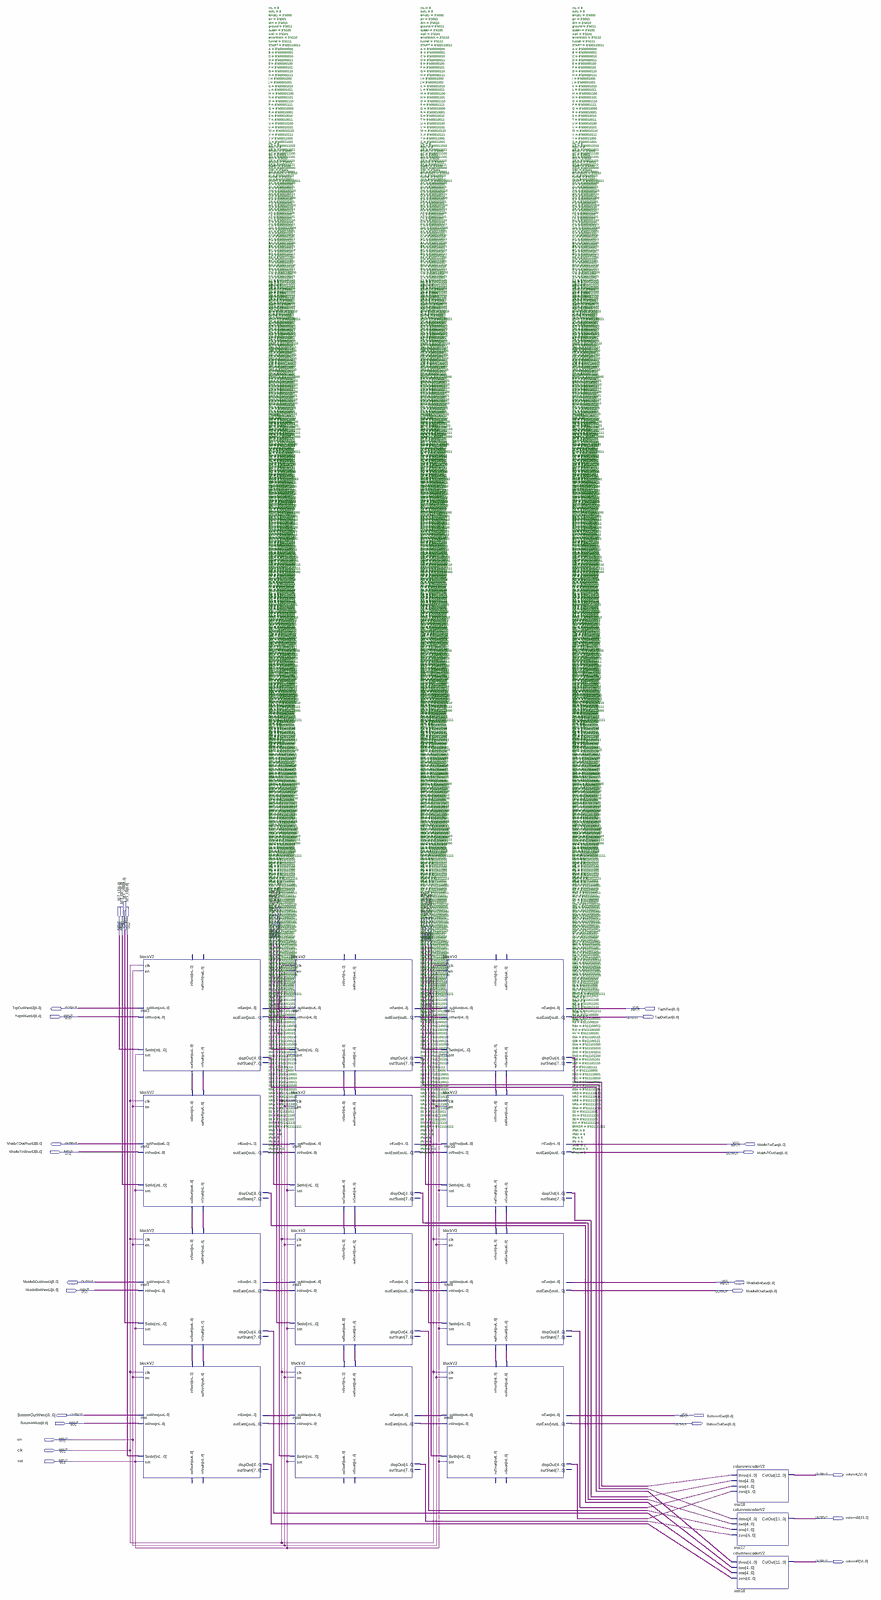
[diagram p0: schematic sheet, whole]
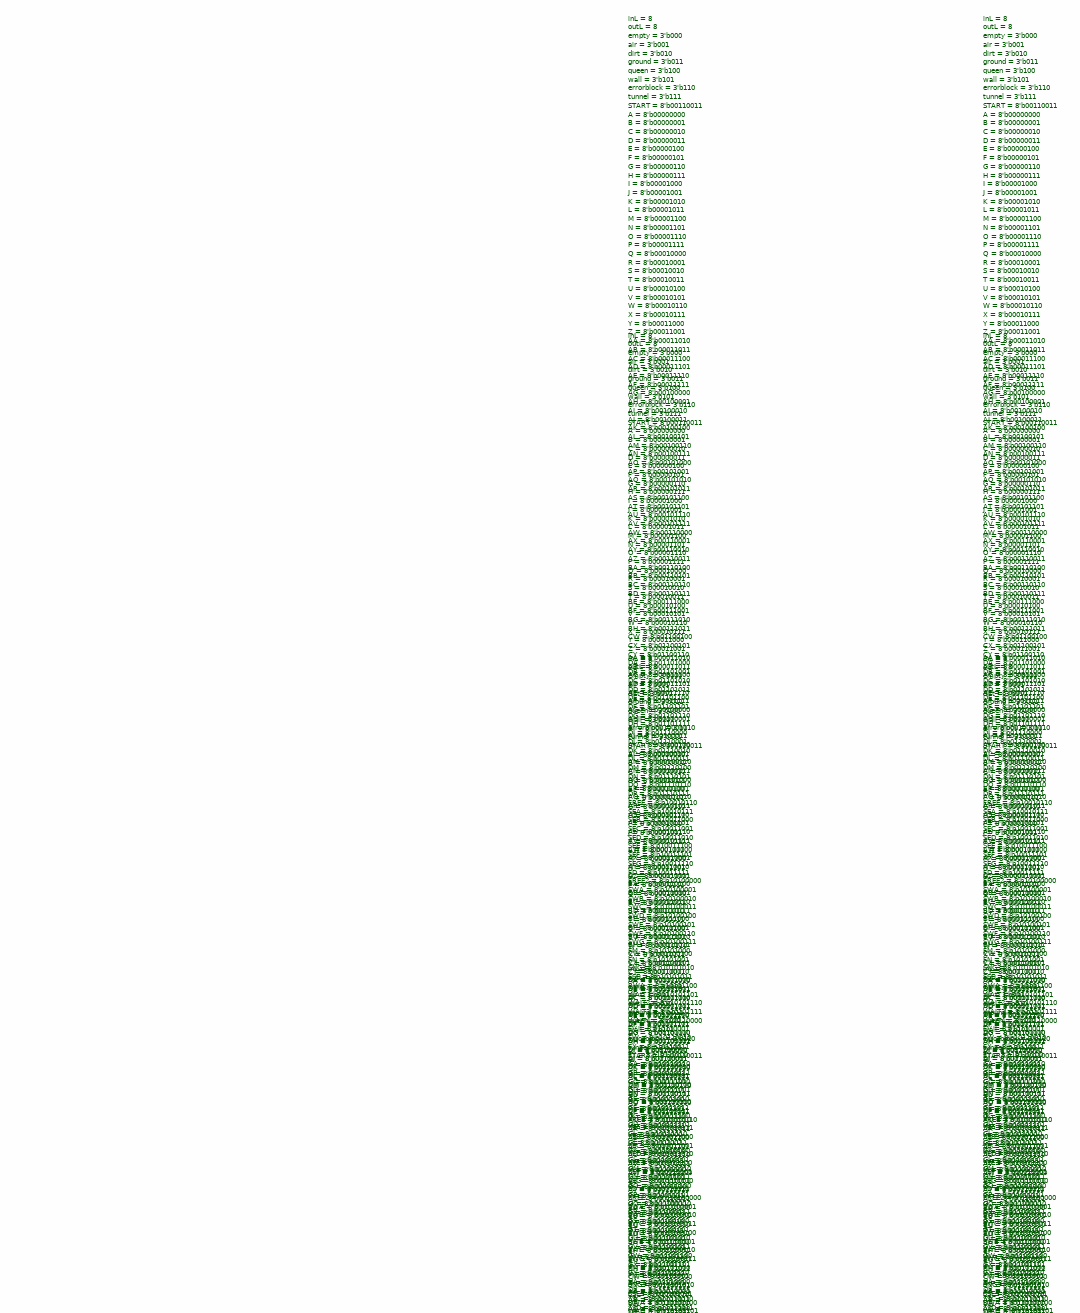
[diagram p1: schematic sheet, upper left part]
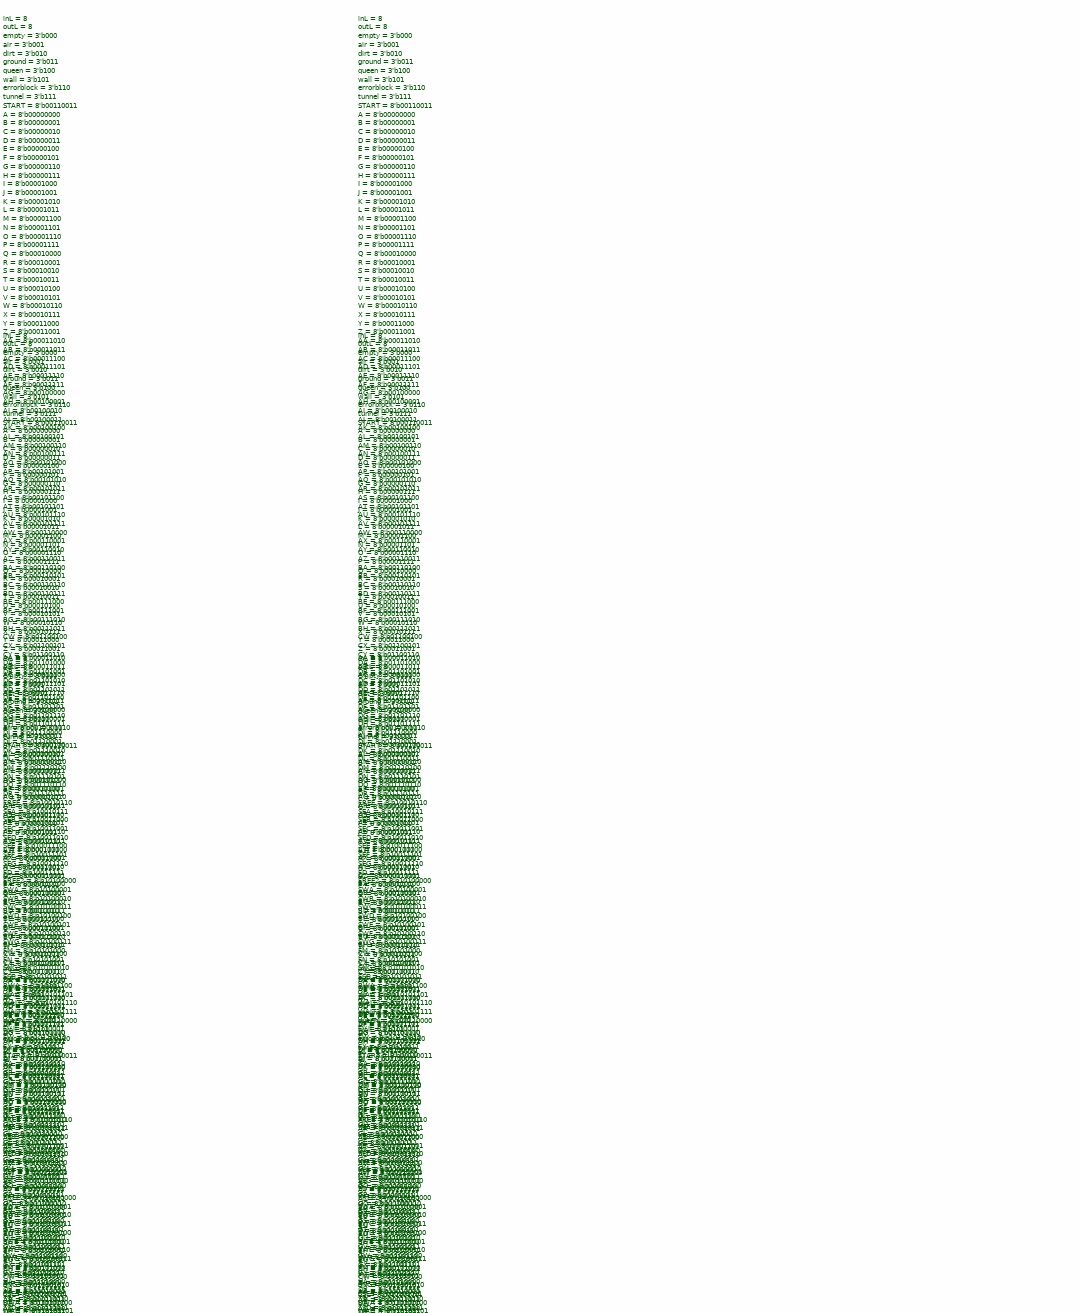
[diagram p2: schematic sheet, upper right part]
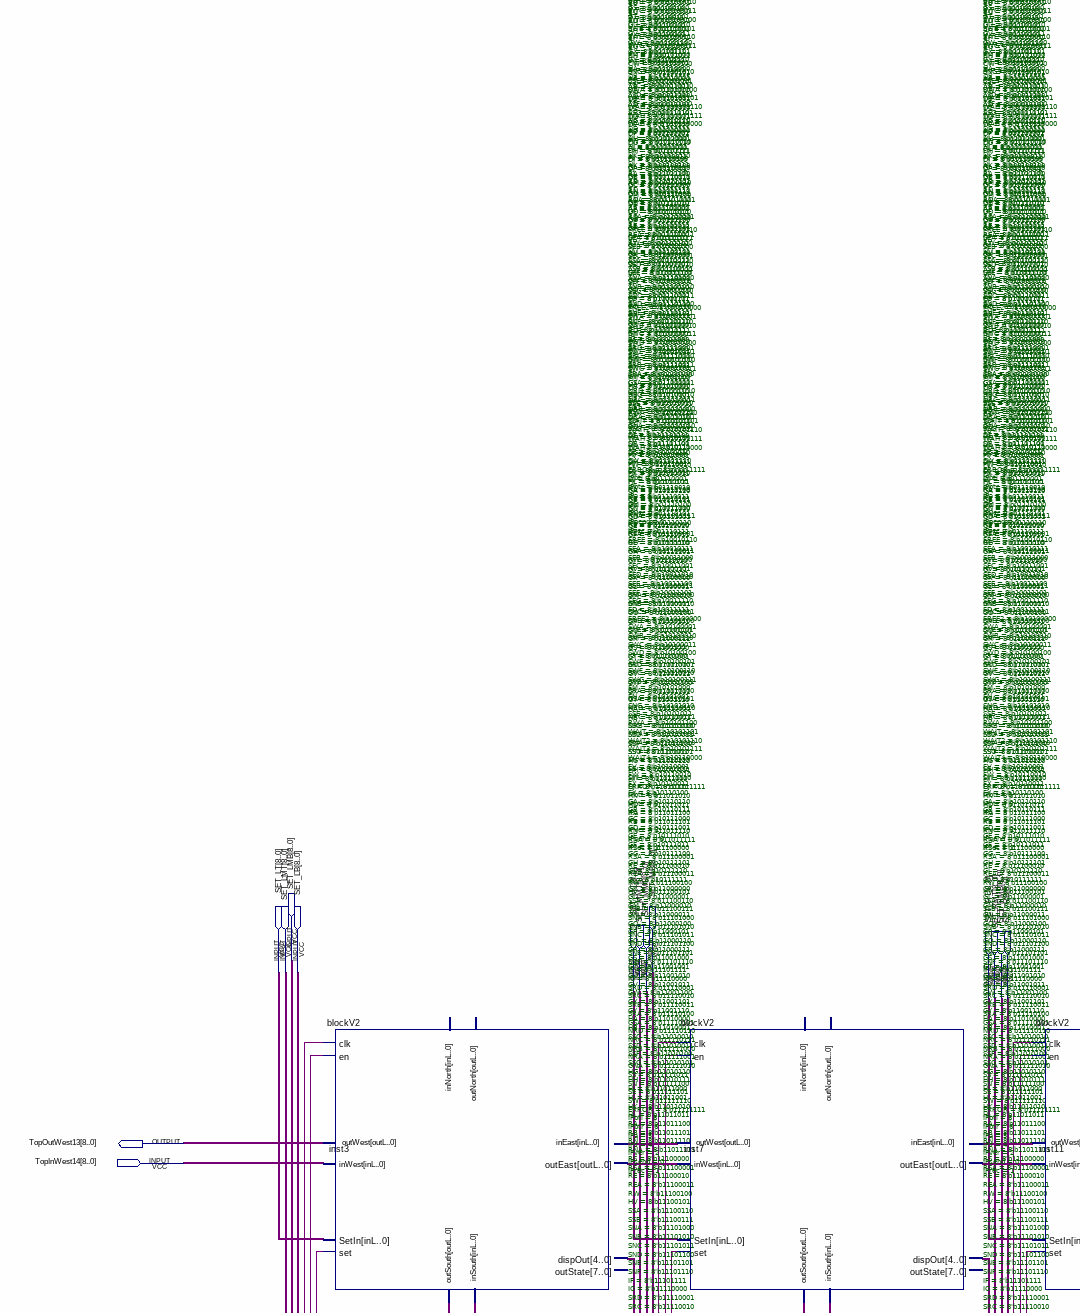
[diagram p3: schematic sheet, middle left part]
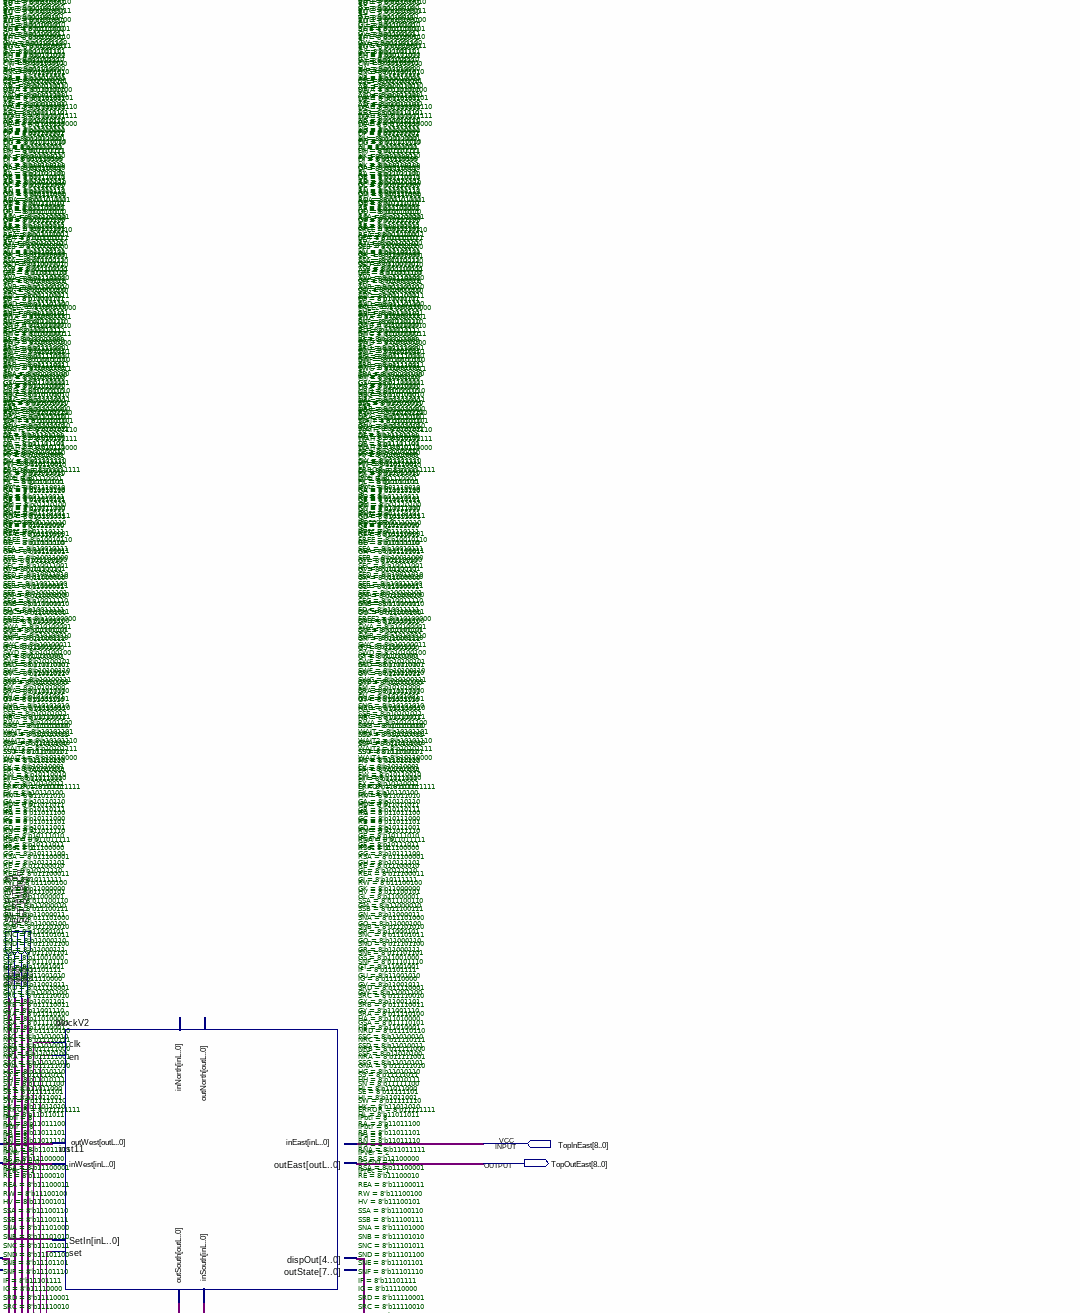
[diagram p4: schematic sheet, middle right part]
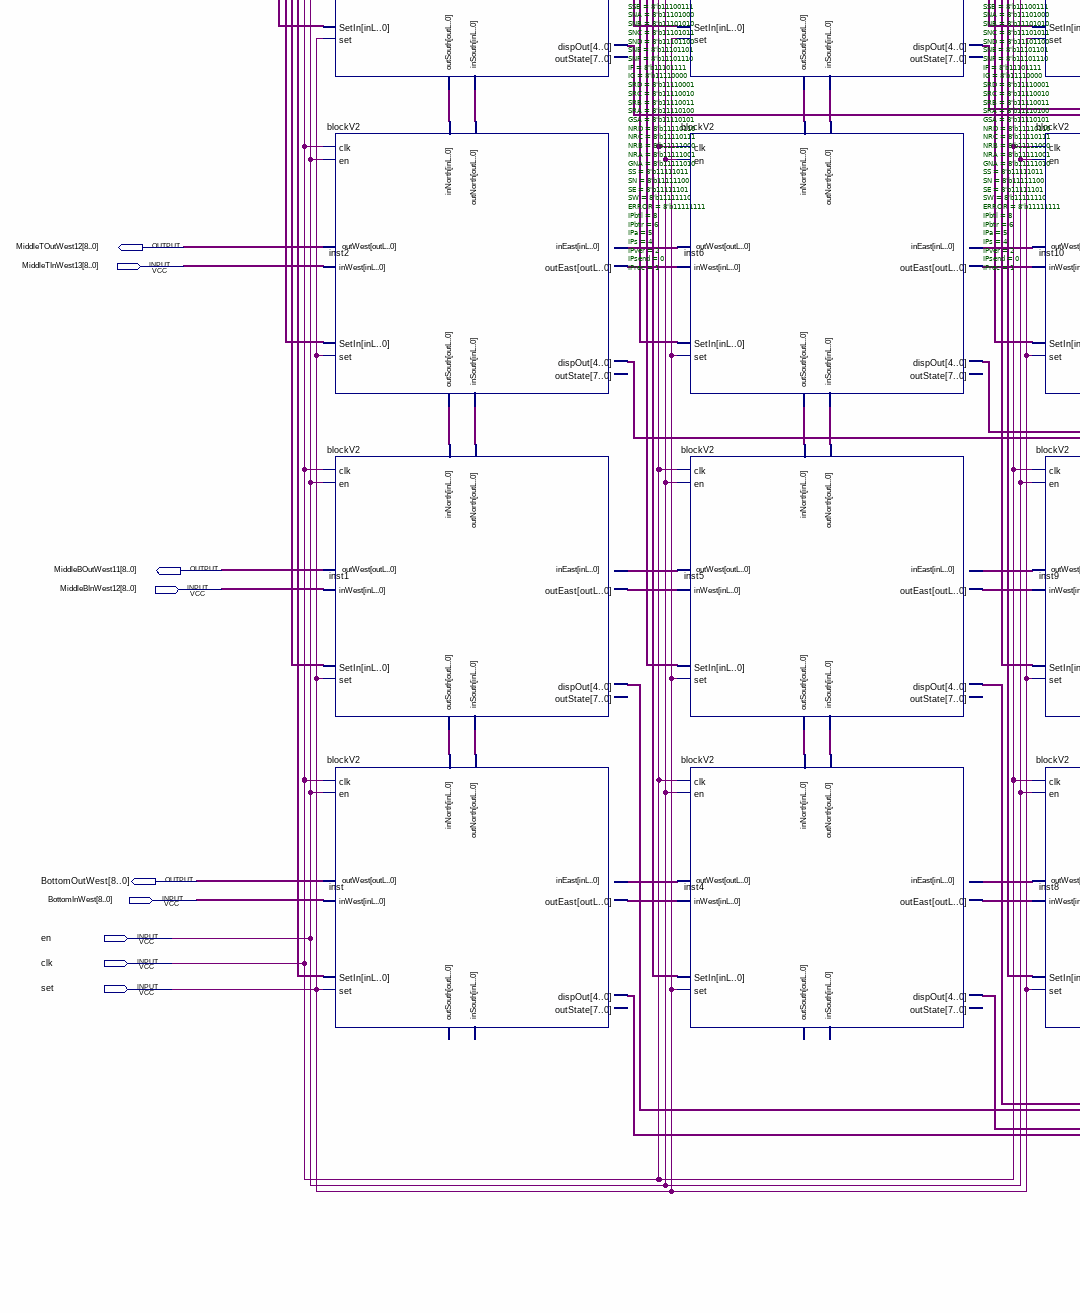
[diagram p5: schematic sheet, lower left part]
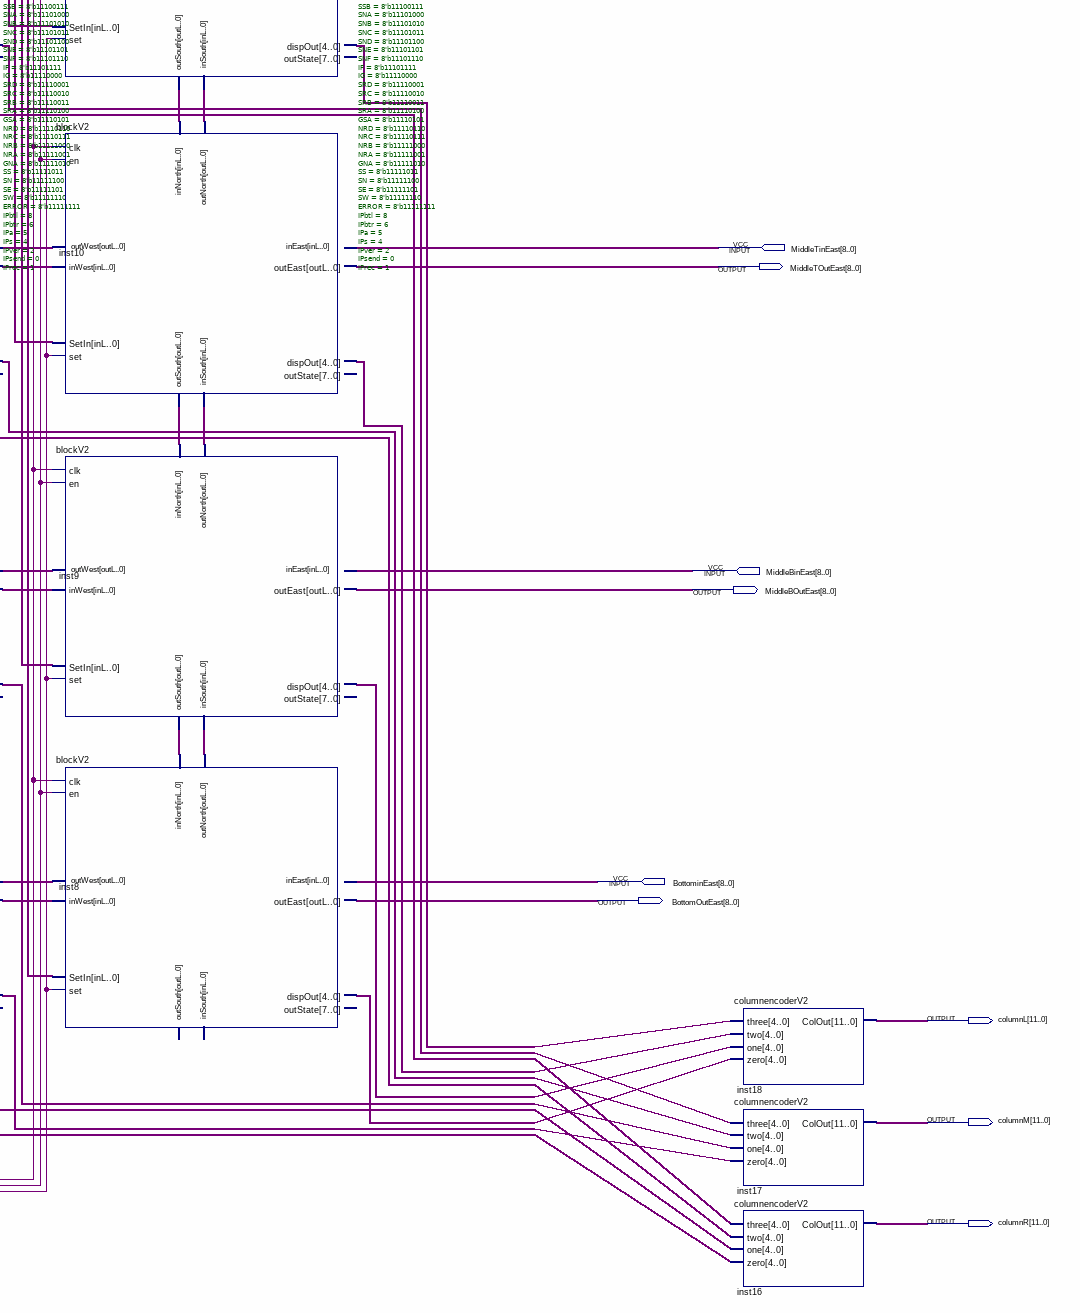
[diagram p6: schematic sheet, lower right part]
// Quartus schematic threeColumns.bdf as structural Verilog: 15 symbols, 34 pins
module threeColumns (
  input  [8:0] SET_LMB,
  input  [8:0] SET_LT,
  input  [8:0] SET_LMT,
  input  [8:0] SET_LB,
  input  [8:0] SET_MB,
  input  [8:0] SET_MT,
  input  [8:0] SET_MMT,
  input  [8:0] SET_MMB,
  input  [8:0] SET_RT,
  input  [8:0] SET_RMT,
  input  [8:0] SET_RMB,
  input  [8:0] SET_RB,
  input  [8:0] TopInEast,
  input  [8:0] TopInWest14,
  input  [8:0] MiddleTinEast,
  input  [8:0] MiddleTInWest13,
  input  [8:0] MiddleBinEast,
  input  [8:0] MiddleBInWest12,
  input  [8:0] BottominEast,
  input  [8:0] BottomInWest,
  input  en,
  input  clk,
  input  set,
  output [8:0] TopOutWest13,
  output [8:0] TopOutEast,
  output [8:0] MiddleTOutWest12,
  output [8:0] MiddleTOutEast,
  output [8:0] MiddleBOutWest11,
  output [8:0] MiddleBOutEast,
  output [8:0] BottomOutWest,
  output [8:0] BottomOutEast,
  output [11:0] columnL,
  output [11:0] columnM,
  output [11:0] columnR
);

  wire [4:0] inst1_dispout, inst2_dispout, inst3_dispout, inst4_dispout, inst5_dispout, inst6_dispout,
       inst7_dispout, inst8_dispout, inst9_dispout, inst10_dispout, inst11_dispout, inst_dispout;
  wire [8:0] inst1_outeast, inst1_outnorth, inst1_outsouth, inst2_outeast, inst2_outnorth, inst2_outsouth,
       inst3_outeast, inst3_outsouth, inst4_outeast, inst4_outnorth, inst4_outwest, inst5_outeast,
       inst5_outnorth, inst5_outsouth, inst5_outwest, inst6_outeast, inst6_outnorth, inst6_outsouth,
       inst6_outwest, inst7_outeast, inst7_outsouth, inst7_outwest, inst8_outnorth, inst8_outwest,
       inst9_outnorth, inst9_outsouth, inst9_outwest, inst10_outnorth, inst10_outsouth, inst10_outwest,
       inst11_outsouth, inst11_outwest, inst_outeast, inst_outnorth;

  blockV2 #(.inL(8), .outL(8), .empty(3'b000), .air(3'b001), .dirt(3'b010), .ground(3'b011), .queen(3'b100), .wall(3'b101), .errorblock(3'b110), .tunnel(3'b111), .START(8'b00110011), .A(8'b00000000), .B(8'b00000001), .C(8'b00000010), .D(8'b00000011), .E(8'b00000100), .F(8'b00000101), .G(8'b00000110), .H(8'b00000111), .I(8'b00001000), .J(8'b00001001), .K(8'b00001010), .L(8'b00001011), .M(8'b00001100), .N(8'b00001101), .O(8'b00001110), .P(8'b00001111), .Q(8'b00010000), .R(8'b00010001), .S(8'b00010010), .T(8'b00010011), .U(8'b00010100), .V(8'b00010101), .W(8'b00010110), .X(8'b00010111), .Y(8'b00011000), .Z(8'b00011001), .AA(8'b00011010), .AB(8'b00011011), .AC(8'b00011100), .AD(8'b00011101), .AE(8'b00011110), .AF(8'b00011111), .AG(8'b00100000), .AH(8'b00100001), .AI(8'b00100010), .AJ(8'b00100011), .AK(8'b00100100), .AL(8'b00100101), .AM(8'b00100110), .AN(8'b00100111), .AO(8'b00101000), .AP(8'b00101001), .AQ(8'b00101010), .AR(8'b00101011), .AS(8'b00101100), .AT(8'b00101101), .AU(8'b00101110), .AV(8'b00101111), .AW(8'b00110000), .AX(8'b00110001), .AY(8'b00110010), .AZ(8'b00110011), .BA(8'b00110100), .BB(8'b00110101), .BC(8'b00110110), .BD(8'b00110111), .BE(8'b00111000), .BF(8'b00111001), .BG(8'b00111010), .BH(8'b00111011), .CW(8'b01100100), .CX(8'b01100101), .CY(8'b01100110), .DA(8'b01101000), .DB(8'b01101001), .DC(8'b01101010), .DD(8'b01101011), .DE(8'b01101100), .DF(8'b01101101), .DG(8'b01101110), .DH(8'b01101111), .DI(8'b01110000), .DJ(8'b01110001), .DK(8'b01110010), .DL(8'b01110011), .DM(8'b01110100), .DN(8'b01110101), .DO(8'b01110110), .DP(8'b01110111), .FREE(8'b10010110), .SEA(8'b10010111), .SEB(8'b10011000), .SEC(8'b10011001), .SED(8'b10011010), .SEE(8'b10011100), .SEF(8'b10011101), .SEG(8'b10011110), .FD(8'b10011111), .FREE2(8'b10100000), .SWA(8'b10100001), .SWB(8'b10100010), .SWC(8'b10100011), .SWD(8'b10100100), .SWE(8'b10100101), .SWF(8'b10100110), .SWG(8'b10100111), .FM(8'b10101000), .FN(8'b10101001), .SNG(8'b10101010), .SSE(8'b10101011), .RWA(8'b10101100), .WAIT(8'b10101101), .WAIT2(8'b10101110), .WAIT3(8'b10101111), .WAIT4(8'b10110000), .FV(8'b10110001), .FW(8'b10110010), .FX(8'b10110011), .FY(8'b10110100), .GA(8'b10110110), .GB(8'b10110111), .GC(8'b10111000), .GD(8'b10111001), .GE(8'b10111010), .GF(8'b10111011), .GG(8'b10111100), .GH(8'b10111101), .GI(8'b10111110), .GJ(8'b10111111), .GK(8'b11000000), .GL(8'b11000001), .GM(8'b11000010), .GN(8'b11000011), .GO(8'b11000100), .GP(8'b11000101), .GQ(8'b11000110), .GR(8'b11000111), .GS(8'b11001000), .GT(8'b11001001), .GU(8'b11001010), .GV(8'b11001011), .GW(8'b11001100), .GX(8'b11001101), .GY(8'b11001110), .HA(8'b11010000), .HB(8'b11010001), .SSC(8'b11010010), .SSD(8'b11010011), .SSF(8'b11010100), .SSG(8'b11010101), .HG(8'b11010110), .HH(8'b11010111), .HI(8'b11011000), .HJ(8'b11011001), .HK(8'b11011010), .HL(8'b11011011), .RA(8'b11011100), .RB(8'b11011101), .RN(8'b11011110), .RNA(8'b11011111), .RS(8'b11100000), .RSA(8'b11100001), .RE(8'b11100010), .REA(8'b11100011), .RW(8'b11100100), .HV(8'b11100101), .SSA(8'b11100110), .SSB(8'b11100111), .SNA(8'b11101000), .SNB(8'b11101010), .SNC(8'b11101011), .SND(8'b11101100), .SNE(8'b11101101), .SNF(8'b11101110), .IF(8'b11101111), .IG(8'b11110000), .SRD(8'b11110001), .SRC(8'b11110010), .SRB(8'b11110011), .SRA(8'b11110100), .GSA(8'b11110101), .NRD(8'b11110110), .NRC(8'b11110111), .NRB(8'b11111000), .NRA(8'b11111001), .GNA(8'b11111010), .SS(8'b11111011), .SN(8'b11111100), .SE(8'b11111101), .SW(8'b11111110), .ERROR(8'b11111111), .IPbtl(8), .IPbtr(6), .IPa(5), .IPs(4), .IPver(2), .IPsend(0), .IPrec(1)) inst3 (
    .clk(clk), .en(en), .set(set), .SetIn(SET_LT), .inSouth(inst2_outnorth), .inEast(inst7_outwest),
    .inWest(TopInWest14), .outSouth(inst3_outsouth), .outEast(inst3_outeast), .outWest(TopOutWest13),
    .dispOut(inst3_dispout));  // open: inNorth, outNorth, outState
  blockV2 #(.inL(8), .outL(8), .empty(3'b000), .air(3'b001), .dirt(3'b010), .ground(3'b011), .queen(3'b100), .wall(3'b101), .errorblock(3'b110), .tunnel(3'b111), .START(8'b00110011), .A(8'b00000000), .B(8'b00000001), .C(8'b00000010), .D(8'b00000011), .E(8'b00000100), .F(8'b00000101), .G(8'b00000110), .H(8'b00000111), .I(8'b00001000), .J(8'b00001001), .K(8'b00001010), .L(8'b00001011), .M(8'b00001100), .N(8'b00001101), .O(8'b00001110), .P(8'b00001111), .Q(8'b00010000), .R(8'b00010001), .S(8'b00010010), .T(8'b00010011), .U(8'b00010100), .V(8'b00010101), .W(8'b00010110), .X(8'b00010111), .Y(8'b00011000), .Z(8'b00011001), .AA(8'b00011010), .AB(8'b00011011), .AC(8'b00011100), .AD(8'b00011101), .AE(8'b00011110), .AF(8'b00011111), .AG(8'b00100000), .AH(8'b00100001), .AI(8'b00100010), .AJ(8'b00100011), .AK(8'b00100100), .AL(8'b00100101), .AM(8'b00100110), .AN(8'b00100111), .AO(8'b00101000), .AP(8'b00101001), .AQ(8'b00101010), .AR(8'b00101011), .AS(8'b00101100), .AT(8'b00101101), .AU(8'b00101110), .AV(8'b00101111), .AW(8'b00110000), .AX(8'b00110001), .AY(8'b00110010), .AZ(8'b00110011), .BA(8'b00110100), .BB(8'b00110101), .BC(8'b00110110), .BD(8'b00110111), .BE(8'b00111000), .BF(8'b00111001), .BG(8'b00111010), .BH(8'b00111011), .CW(8'b01100100), .CX(8'b01100101), .CY(8'b01100110), .DA(8'b01101000), .DB(8'b01101001), .DC(8'b01101010), .DD(8'b01101011), .DE(8'b01101100), .DF(8'b01101101), .DG(8'b01101110), .DH(8'b01101111), .DI(8'b01110000), .DJ(8'b01110001), .DK(8'b01110010), .DL(8'b01110011), .DM(8'b01110100), .DN(8'b01110101), .DO(8'b01110110), .DP(8'b01110111), .FREE(8'b10010110), .SEA(8'b10010111), .SEB(8'b10011000), .SEC(8'b10011001), .SED(8'b10011010), .SEE(8'b10011100), .SEF(8'b10011101), .SEG(8'b10011110), .FD(8'b10011111), .FREE2(8'b10100000), .SWA(8'b10100001), .SWB(8'b10100010), .SWC(8'b10100011), .SWD(8'b10100100), .SWE(8'b10100101), .SWF(8'b10100110), .SWG(8'b10100111), .FM(8'b10101000), .FN(8'b10101001), .SNG(8'b10101010), .SSE(8'b10101011), .RWA(8'b10101100), .WAIT(8'b10101101), .WAIT2(8'b10101110), .WAIT3(8'b10101111), .WAIT4(8'b10110000), .FV(8'b10110001), .FW(8'b10110010), .FX(8'b10110011), .FY(8'b10110100), .GA(8'b10110110), .GB(8'b10110111), .GC(8'b10111000), .GD(8'b10111001), .GE(8'b10111010), .GF(8'b10111011), .GG(8'b10111100), .GH(8'b10111101), .GI(8'b10111110), .GJ(8'b10111111), .GK(8'b11000000), .GL(8'b11000001), .GM(8'b11000010), .GN(8'b11000011), .GO(8'b11000100), .GP(8'b11000101), .GQ(8'b11000110), .GR(8'b11000111), .GS(8'b11001000), .GT(8'b11001001), .GU(8'b11001010), .GV(8'b11001011), .GW(8'b11001100), .GX(8'b11001101), .GY(8'b11001110), .HA(8'b11010000), .HB(8'b11010001), .SSC(8'b11010010), .SSD(8'b11010011), .SSF(8'b11010100), .SSG(8'b11010101), .HG(8'b11010110), .HH(8'b11010111), .HI(8'b11011000), .HJ(8'b11011001), .HK(8'b11011010), .HL(8'b11011011), .RA(8'b11011100), .RB(8'b11011101), .RN(8'b11011110), .RNA(8'b11011111), .RS(8'b11100000), .RSA(8'b11100001), .RE(8'b11100010), .REA(8'b11100011), .RW(8'b11100100), .HV(8'b11100101), .SSA(8'b11100110), .SSB(8'b11100111), .SNA(8'b11101000), .SNB(8'b11101010), .SNC(8'b11101011), .SND(8'b11101100), .SNE(8'b11101101), .SNF(8'b11101110), .IF(8'b11101111), .IG(8'b11110000), .SRD(8'b11110001), .SRC(8'b11110010), .SRB(8'b11110011), .SRA(8'b11110100), .GSA(8'b11110101), .NRD(8'b11110110), .NRC(8'b11110111), .NRB(8'b11111000), .NRA(8'b11111001), .GNA(8'b11111010), .SS(8'b11111011), .SN(8'b11111100), .SE(8'b11111101), .SW(8'b11111110), .ERROR(8'b11111111), .IPbtl(8), .IPbtr(6), .IPa(5), .IPs(4), .IPver(2), .IPsend(0), .IPrec(1)) inst2 (
    .clk(clk), .en(en), .set(set), .SetIn(SET_LMT), .inNorth(inst3_outsouth), .inSouth(inst1_outnorth),
    .inEast(inst6_outwest), .inWest(MiddleTInWest13), .outNorth(inst2_outnorth), .outSouth(inst2_outsouth),
    .outEast(inst2_outeast), .outWest(MiddleTOutWest12), .dispOut(inst2_dispout));  // open: outState
  blockV2 #(.inL(8), .outL(8), .empty(3'b000), .air(3'b001), .dirt(3'b010), .ground(3'b011), .queen(3'b100), .wall(3'b101), .errorblock(3'b110), .tunnel(3'b111), .START(8'b00110011), .A(8'b00000000), .B(8'b00000001), .C(8'b00000010), .D(8'b00000011), .E(8'b00000100), .F(8'b00000101), .G(8'b00000110), .H(8'b00000111), .I(8'b00001000), .J(8'b00001001), .K(8'b00001010), .L(8'b00001011), .M(8'b00001100), .N(8'b00001101), .O(8'b00001110), .P(8'b00001111), .Q(8'b00010000), .R(8'b00010001), .S(8'b00010010), .T(8'b00010011), .U(8'b00010100), .V(8'b00010101), .W(8'b00010110), .X(8'b00010111), .Y(8'b00011000), .Z(8'b00011001), .AA(8'b00011010), .AB(8'b00011011), .AC(8'b00011100), .AD(8'b00011101), .AE(8'b00011110), .AF(8'b00011111), .AG(8'b00100000), .AH(8'b00100001), .AI(8'b00100010), .AJ(8'b00100011), .AK(8'b00100100), .AL(8'b00100101), .AM(8'b00100110), .AN(8'b00100111), .AO(8'b00101000), .AP(8'b00101001), .AQ(8'b00101010), .AR(8'b00101011), .AS(8'b00101100), .AT(8'b00101101), .AU(8'b00101110), .AV(8'b00101111), .AW(8'b00110000), .AX(8'b00110001), .AY(8'b00110010), .AZ(8'b00110011), .BA(8'b00110100), .BB(8'b00110101), .BC(8'b00110110), .BD(8'b00110111), .BE(8'b00111000), .BF(8'b00111001), .BG(8'b00111010), .BH(8'b00111011), .CW(8'b01100100), .CX(8'b01100101), .CY(8'b01100110), .DA(8'b01101000), .DB(8'b01101001), .DC(8'b01101010), .DD(8'b01101011), .DE(8'b01101100), .DF(8'b01101101), .DG(8'b01101110), .DH(8'b01101111), .DI(8'b01110000), .DJ(8'b01110001), .DK(8'b01110010), .DL(8'b01110011), .DM(8'b01110100), .DN(8'b01110101), .DO(8'b01110110), .DP(8'b01110111), .FREE(8'b10010110), .SEA(8'b10010111), .SEB(8'b10011000), .SEC(8'b10011001), .SED(8'b10011010), .SEE(8'b10011100), .SEF(8'b10011101), .SEG(8'b10011110), .FD(8'b10011111), .FREE2(8'b10100000), .SWA(8'b10100001), .SWB(8'b10100010), .SWC(8'b10100011), .SWD(8'b10100100), .SWE(8'b10100101), .SWF(8'b10100110), .SWG(8'b10100111), .FM(8'b10101000), .FN(8'b10101001), .SNG(8'b10101010), .SSE(8'b10101011), .RWA(8'b10101100), .WAIT(8'b10101101), .WAIT2(8'b10101110), .WAIT3(8'b10101111), .WAIT4(8'b10110000), .FV(8'b10110001), .FW(8'b10110010), .FX(8'b10110011), .FY(8'b10110100), .GA(8'b10110110), .GB(8'b10110111), .GC(8'b10111000), .GD(8'b10111001), .GE(8'b10111010), .GF(8'b10111011), .GG(8'b10111100), .GH(8'b10111101), .GI(8'b10111110), .GJ(8'b10111111), .GK(8'b11000000), .GL(8'b11000001), .GM(8'b11000010), .GN(8'b11000011), .GO(8'b11000100), .GP(8'b11000101), .GQ(8'b11000110), .GR(8'b11000111), .GS(8'b11001000), .GT(8'b11001001), .GU(8'b11001010), .GV(8'b11001011), .GW(8'b11001100), .GX(8'b11001101), .GY(8'b11001110), .HA(8'b11010000), .HB(8'b11010001), .SSC(8'b11010010), .SSD(8'b11010011), .SSF(8'b11010100), .SSG(8'b11010101), .HG(8'b11010110), .HH(8'b11010111), .HI(8'b11011000), .HJ(8'b11011001), .HK(8'b11011010), .HL(8'b11011011), .RA(8'b11011100), .RB(8'b11011101), .RN(8'b11011110), .RNA(8'b11011111), .RS(8'b11100000), .RSA(8'b11100001), .RE(8'b11100010), .REA(8'b11100011), .RW(8'b11100100), .HV(8'b11100101), .SSA(8'b11100110), .SSB(8'b11100111), .SNA(8'b11101000), .SNB(8'b11101010), .SNC(8'b11101011), .SND(8'b11101100), .SNE(8'b11101101), .SNF(8'b11101110), .IF(8'b11101111), .IG(8'b11110000), .SRD(8'b11110001), .SRC(8'b11110010), .SRB(8'b11110011), .SRA(8'b11110100), .GSA(8'b11110101), .NRD(8'b11110110), .NRC(8'b11110111), .NRB(8'b11111000), .NRA(8'b11111001), .GNA(8'b11111010), .SS(8'b11111011), .SN(8'b11111100), .SE(8'b11111101), .SW(8'b11111110), .ERROR(8'b11111111), .IPbtl(8), .IPbtr(6), .IPa(5), .IPs(4), .IPver(2), .IPsend(0), .IPrec(1)) inst1 (
    .clk(clk), .en(en), .set(set), .SetIn(SET_LMB), .inNorth(inst2_outsouth), .inSouth(inst_outnorth),
    .inEast(inst5_outwest), .inWest(MiddleBInWest12), .outNorth(inst1_outnorth), .outSouth(inst1_outsouth),
    .outEast(inst1_outeast), .outWest(MiddleBOutWest11), .dispOut(inst1_dispout));  // open: outState
  blockV2 #(.inL(8), .outL(8), .empty(3'b000), .air(3'b001), .dirt(3'b010), .ground(3'b011), .queen(3'b100), .wall(3'b101), .errorblock(3'b110), .tunnel(3'b111), .START(8'b00110011), .A(8'b00000000), .B(8'b00000001), .C(8'b00000010), .D(8'b00000011), .E(8'b00000100), .F(8'b00000101), .G(8'b00000110), .H(8'b00000111), .I(8'b00001000), .J(8'b00001001), .K(8'b00001010), .L(8'b00001011), .M(8'b00001100), .N(8'b00001101), .O(8'b00001110), .P(8'b00001111), .Q(8'b00010000), .R(8'b00010001), .S(8'b00010010), .T(8'b00010011), .U(8'b00010100), .V(8'b00010101), .W(8'b00010110), .X(8'b00010111), .Y(8'b00011000), .Z(8'b00011001), .AA(8'b00011010), .AB(8'b00011011), .AC(8'b00011100), .AD(8'b00011101), .AE(8'b00011110), .AF(8'b00011111), .AG(8'b00100000), .AH(8'b00100001), .AI(8'b00100010), .AJ(8'b00100011), .AK(8'b00100100), .AL(8'b00100101), .AM(8'b00100110), .AN(8'b00100111), .AO(8'b00101000), .AP(8'b00101001), .AQ(8'b00101010), .AR(8'b00101011), .AS(8'b00101100), .AT(8'b00101101), .AU(8'b00101110), .AV(8'b00101111), .AW(8'b00110000), .AX(8'b00110001), .AY(8'b00110010), .AZ(8'b00110011), .BA(8'b00110100), .BB(8'b00110101), .BC(8'b00110110), .BD(8'b00110111), .BE(8'b00111000), .BF(8'b00111001), .BG(8'b00111010), .BH(8'b00111011), .CW(8'b01100100), .CX(8'b01100101), .CY(8'b01100110), .DA(8'b01101000), .DB(8'b01101001), .DC(8'b01101010), .DD(8'b01101011), .DE(8'b01101100), .DF(8'b01101101), .DG(8'b01101110), .DH(8'b01101111), .DI(8'b01110000), .DJ(8'b01110001), .DK(8'b01110010), .DL(8'b01110011), .DM(8'b01110100), .DN(8'b01110101), .DO(8'b01110110), .DP(8'b01110111), .FREE(8'b10010110), .SEA(8'b10010111), .SEB(8'b10011000), .SEC(8'b10011001), .SED(8'b10011010), .SEE(8'b10011100), .SEF(8'b10011101), .SEG(8'b10011110), .FD(8'b10011111), .FREE2(8'b10100000), .SWA(8'b10100001), .SWB(8'b10100010), .SWC(8'b10100011), .SWD(8'b10100100), .SWE(8'b10100101), .SWF(8'b10100110), .SWG(8'b10100111), .FM(8'b10101000), .FN(8'b10101001), .SNG(8'b10101010), .SSE(8'b10101011), .RWA(8'b10101100), .WAIT(8'b10101101), .WAIT2(8'b10101110), .WAIT3(8'b10101111), .WAIT4(8'b10110000), .FV(8'b10110001), .FW(8'b10110010), .FX(8'b10110011), .FY(8'b10110100), .GA(8'b10110110), .GB(8'b10110111), .GC(8'b10111000), .GD(8'b10111001), .GE(8'b10111010), .GF(8'b10111011), .GG(8'b10111100), .GH(8'b10111101), .GI(8'b10111110), .GJ(8'b10111111), .GK(8'b11000000), .GL(8'b11000001), .GM(8'b11000010), .GN(8'b11000011), .GO(8'b11000100), .GP(8'b11000101), .GQ(8'b11000110), .GR(8'b11000111), .GS(8'b11001000), .GT(8'b11001001), .GU(8'b11001010), .GV(8'b11001011), .GW(8'b11001100), .GX(8'b11001101), .GY(8'b11001110), .HA(8'b11010000), .HB(8'b11010001), .SSC(8'b11010010), .SSD(8'b11010011), .SSF(8'b11010100), .SSG(8'b11010101), .HG(8'b11010110), .HH(8'b11010111), .HI(8'b11011000), .HJ(8'b11011001), .HK(8'b11011010), .HL(8'b11011011), .RA(8'b11011100), .RB(8'b11011101), .RN(8'b11011110), .RNA(8'b11011111), .RS(8'b11100000), .RSA(8'b11100001), .RE(8'b11100010), .REA(8'b11100011), .RW(8'b11100100), .HV(8'b11100101), .SSA(8'b11100110), .SSB(8'b11100111), .SNA(8'b11101000), .SNB(8'b11101010), .SNC(8'b11101011), .SND(8'b11101100), .SNE(8'b11101101), .SNF(8'b11101110), .IF(8'b11101111), .IG(8'b11110000), .SRD(8'b11110001), .SRC(8'b11110010), .SRB(8'b11110011), .SRA(8'b11110100), .GSA(8'b11110101), .NRD(8'b11110110), .NRC(8'b11110111), .NRB(8'b11111000), .NRA(8'b11111001), .GNA(8'b11111010), .SS(8'b11111011), .SN(8'b11111100), .SE(8'b11111101), .SW(8'b11111110), .ERROR(8'b11111111), .IPbtl(8), .IPbtr(6), .IPa(5), .IPs(4), .IPver(2), .IPsend(0), .IPrec(1)) inst (
    .clk(clk), .en(en), .set(set), .SetIn(SET_LB), .inNorth(inst1_outsouth), .inEast(inst4_outwest),
    .inWest(BottomInWest), .outNorth(inst_outnorth), .outEast(inst_outeast), .outWest(BottomOutWest),
    .dispOut(inst_dispout));  // open: inSouth, outSouth, outState
  blockV2 #(.inL(8), .outL(8), .empty(3'b000), .air(3'b001), .dirt(3'b010), .ground(3'b011), .queen(3'b100), .wall(3'b101), .errorblock(3'b110), .tunnel(3'b111), .START(8'b00110011), .A(8'b00000000), .B(8'b00000001), .C(8'b00000010), .D(8'b00000011), .E(8'b00000100), .F(8'b00000101), .G(8'b00000110), .H(8'b00000111), .I(8'b00001000), .J(8'b00001001), .K(8'b00001010), .L(8'b00001011), .M(8'b00001100), .N(8'b00001101), .O(8'b00001110), .P(8'b00001111), .Q(8'b00010000), .R(8'b00010001), .S(8'b00010010), .T(8'b00010011), .U(8'b00010100), .V(8'b00010101), .W(8'b00010110), .X(8'b00010111), .Y(8'b00011000), .Z(8'b00011001), .AA(8'b00011010), .AB(8'b00011011), .AC(8'b00011100), .AD(8'b00011101), .AE(8'b00011110), .AF(8'b00011111), .AG(8'b00100000), .AH(8'b00100001), .AI(8'b00100010), .AJ(8'b00100011), .AK(8'b00100100), .AL(8'b00100101), .AM(8'b00100110), .AN(8'b00100111), .AO(8'b00101000), .AP(8'b00101001), .AQ(8'b00101010), .AR(8'b00101011), .AS(8'b00101100), .AT(8'b00101101), .AU(8'b00101110), .AV(8'b00101111), .AW(8'b00110000), .AX(8'b00110001), .AY(8'b00110010), .AZ(8'b00110011), .BA(8'b00110100), .BB(8'b00110101), .BC(8'b00110110), .BD(8'b00110111), .BE(8'b00111000), .BF(8'b00111001), .BG(8'b00111010), .BH(8'b00111011), .CW(8'b01100100), .CX(8'b01100101), .CY(8'b01100110), .DA(8'b01101000), .DB(8'b01101001), .DC(8'b01101010), .DD(8'b01101011), .DE(8'b01101100), .DF(8'b01101101), .DG(8'b01101110), .DH(8'b01101111), .DI(8'b01110000), .DJ(8'b01110001), .DK(8'b01110010), .DL(8'b01110011), .DM(8'b01110100), .DN(8'b01110101), .DO(8'b01110110), .DP(8'b01110111), .FREE(8'b10010110), .SEA(8'b10010111), .SEB(8'b10011000), .SEC(8'b10011001), .SED(8'b10011010), .SEE(8'b10011100), .SEF(8'b10011101), .SEG(8'b10011110), .FD(8'b10011111), .FREE2(8'b10100000), .SWA(8'b10100001), .SWB(8'b10100010), .SWC(8'b10100011), .SWD(8'b10100100), .SWE(8'b10100101), .SWF(8'b10100110), .SWG(8'b10100111), .FM(8'b10101000), .FN(8'b10101001), .SNG(8'b10101010), .SSE(8'b10101011), .RWA(8'b10101100), .WAIT(8'b10101101), .WAIT2(8'b10101110), .WAIT3(8'b10101111), .WAIT4(8'b10110000), .FV(8'b10110001), .FW(8'b10110010), .FX(8'b10110011), .FY(8'b10110100), .GA(8'b10110110), .GB(8'b10110111), .GC(8'b10111000), .GD(8'b10111001), .GE(8'b10111010), .GF(8'b10111011), .GG(8'b10111100), .GH(8'b10111101), .GI(8'b10111110), .GJ(8'b10111111), .GK(8'b11000000), .GL(8'b11000001), .GM(8'b11000010), .GN(8'b11000011), .GO(8'b11000100), .GP(8'b11000101), .GQ(8'b11000110), .GR(8'b11000111), .GS(8'b11001000), .GT(8'b11001001), .GU(8'b11001010), .GV(8'b11001011), .GW(8'b11001100), .GX(8'b11001101), .GY(8'b11001110), .HA(8'b11010000), .HB(8'b11010001), .SSC(8'b11010010), .SSD(8'b11010011), .SSF(8'b11010100), .SSG(8'b11010101), .HG(8'b11010110), .HH(8'b11010111), .HI(8'b11011000), .HJ(8'b11011001), .HK(8'b11011010), .HL(8'b11011011), .RA(8'b11011100), .RB(8'b11011101), .RN(8'b11011110), .RNA(8'b11011111), .RS(8'b11100000), .RSA(8'b11100001), .RE(8'b11100010), .REA(8'b11100011), .RW(8'b11100100), .HV(8'b11100101), .SSA(8'b11100110), .SSB(8'b11100111), .SNA(8'b11101000), .SNB(8'b11101010), .SNC(8'b11101011), .SND(8'b11101100), .SNE(8'b11101101), .SNF(8'b11101110), .IF(8'b11101111), .IG(8'b11110000), .SRD(8'b11110001), .SRC(8'b11110010), .SRB(8'b11110011), .SRA(8'b11110100), .GSA(8'b11110101), .NRD(8'b11110110), .NRC(8'b11110111), .NRB(8'b11111000), .NRA(8'b11111001), .GNA(8'b11111010), .SS(8'b11111011), .SN(8'b11111100), .SE(8'b11111101), .SW(8'b11111110), .ERROR(8'b11111111), .IPbtl(8), .IPbtr(6), .IPa(5), .IPs(4), .IPver(2), .IPsend(0), .IPrec(1)) inst7 (
    .clk(clk), .en(en), .set(set), .SetIn(SET_MT), .inSouth(inst6_outnorth), .inEast(inst11_outwest),
    .inWest(inst3_outeast), .outSouth(inst7_outsouth), .outEast(inst7_outeast), .outWest(inst7_outwest),
    .dispOut(inst7_dispout));  // open: inNorth, outNorth, outState
  blockV2 #(.inL(8), .outL(8), .empty(3'b000), .air(3'b001), .dirt(3'b010), .ground(3'b011), .queen(3'b100), .wall(3'b101), .errorblock(3'b110), .tunnel(3'b111), .START(8'b00110011), .A(8'b00000000), .B(8'b00000001), .C(8'b00000010), .D(8'b00000011), .E(8'b00000100), .F(8'b00000101), .G(8'b00000110), .H(8'b00000111), .I(8'b00001000), .J(8'b00001001), .K(8'b00001010), .L(8'b00001011), .M(8'b00001100), .N(8'b00001101), .O(8'b00001110), .P(8'b00001111), .Q(8'b00010000), .R(8'b00010001), .S(8'b00010010), .T(8'b00010011), .U(8'b00010100), .V(8'b00010101), .W(8'b00010110), .X(8'b00010111), .Y(8'b00011000), .Z(8'b00011001), .AA(8'b00011010), .AB(8'b00011011), .AC(8'b00011100), .AD(8'b00011101), .AE(8'b00011110), .AF(8'b00011111), .AG(8'b00100000), .AH(8'b00100001), .AI(8'b00100010), .AJ(8'b00100011), .AK(8'b00100100), .AL(8'b00100101), .AM(8'b00100110), .AN(8'b00100111), .AO(8'b00101000), .AP(8'b00101001), .AQ(8'b00101010), .AR(8'b00101011), .AS(8'b00101100), .AT(8'b00101101), .AU(8'b00101110), .AV(8'b00101111), .AW(8'b00110000), .AX(8'b00110001), .AY(8'b00110010), .AZ(8'b00110011), .BA(8'b00110100), .BB(8'b00110101), .BC(8'b00110110), .BD(8'b00110111), .BE(8'b00111000), .BF(8'b00111001), .BG(8'b00111010), .BH(8'b00111011), .CW(8'b01100100), .CX(8'b01100101), .CY(8'b01100110), .DA(8'b01101000), .DB(8'b01101001), .DC(8'b01101010), .DD(8'b01101011), .DE(8'b01101100), .DF(8'b01101101), .DG(8'b01101110), .DH(8'b01101111), .DI(8'b01110000), .DJ(8'b01110001), .DK(8'b01110010), .DL(8'b01110011), .DM(8'b01110100), .DN(8'b01110101), .DO(8'b01110110), .DP(8'b01110111), .FREE(8'b10010110), .SEA(8'b10010111), .SEB(8'b10011000), .SEC(8'b10011001), .SED(8'b10011010), .SEE(8'b10011100), .SEF(8'b10011101), .SEG(8'b10011110), .FD(8'b10011111), .FREE2(8'b10100000), .SWA(8'b10100001), .SWB(8'b10100010), .SWC(8'b10100011), .SWD(8'b10100100), .SWE(8'b10100101), .SWF(8'b10100110), .SWG(8'b10100111), .FM(8'b10101000), .FN(8'b10101001), .SNG(8'b10101010), .SSE(8'b10101011), .RWA(8'b10101100), .WAIT(8'b10101101), .WAIT2(8'b10101110), .WAIT3(8'b10101111), .WAIT4(8'b10110000), .FV(8'b10110001), .FW(8'b10110010), .FX(8'b10110011), .FY(8'b10110100), .GA(8'b10110110), .GB(8'b10110111), .GC(8'b10111000), .GD(8'b10111001), .GE(8'b10111010), .GF(8'b10111011), .GG(8'b10111100), .GH(8'b10111101), .GI(8'b10111110), .GJ(8'b10111111), .GK(8'b11000000), .GL(8'b11000001), .GM(8'b11000010), .GN(8'b11000011), .GO(8'b11000100), .GP(8'b11000101), .GQ(8'b11000110), .GR(8'b11000111), .GS(8'b11001000), .GT(8'b11001001), .GU(8'b11001010), .GV(8'b11001011), .GW(8'b11001100), .GX(8'b11001101), .GY(8'b11001110), .HA(8'b11010000), .HB(8'b11010001), .SSC(8'b11010010), .SSD(8'b11010011), .SSF(8'b11010100), .SSG(8'b11010101), .HG(8'b11010110), .HH(8'b11010111), .HI(8'b11011000), .HJ(8'b11011001), .HK(8'b11011010), .HL(8'b11011011), .RA(8'b11011100), .RB(8'b11011101), .RN(8'b11011110), .RNA(8'b11011111), .RS(8'b11100000), .RSA(8'b11100001), .RE(8'b11100010), .REA(8'b11100011), .RW(8'b11100100), .HV(8'b11100101), .SSA(8'b11100110), .SSB(8'b11100111), .SNA(8'b11101000), .SNB(8'b11101010), .SNC(8'b11101011), .SND(8'b11101100), .SNE(8'b11101101), .SNF(8'b11101110), .IF(8'b11101111), .IG(8'b11110000), .SRD(8'b11110001), .SRC(8'b11110010), .SRB(8'b11110011), .SRA(8'b11110100), .GSA(8'b11110101), .NRD(8'b11110110), .NRC(8'b11110111), .NRB(8'b11111000), .NRA(8'b11111001), .GNA(8'b11111010), .SS(8'b11111011), .SN(8'b11111100), .SE(8'b11111101), .SW(8'b11111110), .ERROR(8'b11111111), .IPbtl(8), .IPbtr(6), .IPa(5), .IPs(4), .IPver(2), .IPsend(0), .IPrec(1)) inst6 (
    .clk(clk), .en(en), .set(set), .SetIn(SET_MMT), .inNorth(inst7_outsouth), .inSouth(inst5_outnorth),
    .inEast(inst10_outwest), .inWest(inst2_outeast), .outNorth(inst6_outnorth), .outSouth(inst6_outsouth),
    .outEast(inst6_outeast), .outWest(inst6_outwest), .dispOut(inst6_dispout));  // open: outState
  blockV2 #(.inL(8), .outL(8), .empty(3'b000), .air(3'b001), .dirt(3'b010), .ground(3'b011), .queen(3'b100), .wall(3'b101), .errorblock(3'b110), .tunnel(3'b111), .START(8'b00110011), .A(8'b00000000), .B(8'b00000001), .C(8'b00000010), .D(8'b00000011), .E(8'b00000100), .F(8'b00000101), .G(8'b00000110), .H(8'b00000111), .I(8'b00001000), .J(8'b00001001), .K(8'b00001010), .L(8'b00001011), .M(8'b00001100), .N(8'b00001101), .O(8'b00001110), .P(8'b00001111), .Q(8'b00010000), .R(8'b00010001), .S(8'b00010010), .T(8'b00010011), .U(8'b00010100), .V(8'b00010101), .W(8'b00010110), .X(8'b00010111), .Y(8'b00011000), .Z(8'b00011001), .AA(8'b00011010), .AB(8'b00011011), .AC(8'b00011100), .AD(8'b00011101), .AE(8'b00011110), .AF(8'b00011111), .AG(8'b00100000), .AH(8'b00100001), .AI(8'b00100010), .AJ(8'b00100011), .AK(8'b00100100), .AL(8'b00100101), .AM(8'b00100110), .AN(8'b00100111), .AO(8'b00101000), .AP(8'b00101001), .AQ(8'b00101010), .AR(8'b00101011), .AS(8'b00101100), .AT(8'b00101101), .AU(8'b00101110), .AV(8'b00101111), .AW(8'b00110000), .AX(8'b00110001), .AY(8'b00110010), .AZ(8'b00110011), .BA(8'b00110100), .BB(8'b00110101), .BC(8'b00110110), .BD(8'b00110111), .BE(8'b00111000), .BF(8'b00111001), .BG(8'b00111010), .BH(8'b00111011), .CW(8'b01100100), .CX(8'b01100101), .CY(8'b01100110), .DA(8'b01101000), .DB(8'b01101001), .DC(8'b01101010), .DD(8'b01101011), .DE(8'b01101100), .DF(8'b01101101), .DG(8'b01101110), .DH(8'b01101111), .DI(8'b01110000), .DJ(8'b01110001), .DK(8'b01110010), .DL(8'b01110011), .DM(8'b01110100), .DN(8'b01110101), .DO(8'b01110110), .DP(8'b01110111), .FREE(8'b10010110), .SEA(8'b10010111), .SEB(8'b10011000), .SEC(8'b10011001), .SED(8'b10011010), .SEE(8'b10011100), .SEF(8'b10011101), .SEG(8'b10011110), .FD(8'b10011111), .FREE2(8'b10100000), .SWA(8'b10100001), .SWB(8'b10100010), .SWC(8'b10100011), .SWD(8'b10100100), .SWE(8'b10100101), .SWF(8'b10100110), .SWG(8'b10100111), .FM(8'b10101000), .FN(8'b10101001), .SNG(8'b10101010), .SSE(8'b10101011), .RWA(8'b10101100), .WAIT(8'b10101101), .WAIT2(8'b10101110), .WAIT3(8'b10101111), .WAIT4(8'b10110000), .FV(8'b10110001), .FW(8'b10110010), .FX(8'b10110011), .FY(8'b10110100), .GA(8'b10110110), .GB(8'b10110111), .GC(8'b10111000), .GD(8'b10111001), .GE(8'b10111010), .GF(8'b10111011), .GG(8'b10111100), .GH(8'b10111101), .GI(8'b10111110), .GJ(8'b10111111), .GK(8'b11000000), .GL(8'b11000001), .GM(8'b11000010), .GN(8'b11000011), .GO(8'b11000100), .GP(8'b11000101), .GQ(8'b11000110), .GR(8'b11000111), .GS(8'b11001000), .GT(8'b11001001), .GU(8'b11001010), .GV(8'b11001011), .GW(8'b11001100), .GX(8'b11001101), .GY(8'b11001110), .HA(8'b11010000), .HB(8'b11010001), .SSC(8'b11010010), .SSD(8'b11010011), .SSF(8'b11010100), .SSG(8'b11010101), .HG(8'b11010110), .HH(8'b11010111), .HI(8'b11011000), .HJ(8'b11011001), .HK(8'b11011010), .HL(8'b11011011), .RA(8'b11011100), .RB(8'b11011101), .RN(8'b11011110), .RNA(8'b11011111), .RS(8'b11100000), .RSA(8'b11100001), .RE(8'b11100010), .REA(8'b11100011), .RW(8'b11100100), .HV(8'b11100101), .SSA(8'b11100110), .SSB(8'b11100111), .SNA(8'b11101000), .SNB(8'b11101010), .SNC(8'b11101011), .SND(8'b11101100), .SNE(8'b11101101), .SNF(8'b11101110), .IF(8'b11101111), .IG(8'b11110000), .SRD(8'b11110001), .SRC(8'b11110010), .SRB(8'b11110011), .SRA(8'b11110100), .GSA(8'b11110101), .NRD(8'b11110110), .NRC(8'b11110111), .NRB(8'b11111000), .NRA(8'b11111001), .GNA(8'b11111010), .SS(8'b11111011), .SN(8'b11111100), .SE(8'b11111101), .SW(8'b11111110), .ERROR(8'b11111111), .IPbtl(8), .IPbtr(6), .IPa(5), .IPs(4), .IPver(2), .IPsend(0), .IPrec(1)) inst5 (
    .clk(clk), .en(en), .set(set), .SetIn(SET_MMB), .inNorth(inst6_outsouth), .inSouth(inst4_outnorth),
    .inEast(inst9_outwest), .inWest(inst1_outeast), .outNorth(inst5_outnorth), .outSouth(inst5_outsouth),
    .outEast(inst5_outeast), .outWest(inst5_outwest), .dispOut(inst5_dispout));  // open: outState
  blockV2 #(.inL(8), .outL(8), .empty(3'b000), .air(3'b001), .dirt(3'b010), .ground(3'b011), .queen(3'b100), .wall(3'b101), .errorblock(3'b110), .tunnel(3'b111), .START(8'b00110011), .A(8'b00000000), .B(8'b00000001), .C(8'b00000010), .D(8'b00000011), .E(8'b00000100), .F(8'b00000101), .G(8'b00000110), .H(8'b00000111), .I(8'b00001000), .J(8'b00001001), .K(8'b00001010), .L(8'b00001011), .M(8'b00001100), .N(8'b00001101), .O(8'b00001110), .P(8'b00001111), .Q(8'b00010000), .R(8'b00010001), .S(8'b00010010), .T(8'b00010011), .U(8'b00010100), .V(8'b00010101), .W(8'b00010110), .X(8'b00010111), .Y(8'b00011000), .Z(8'b00011001), .AA(8'b00011010), .AB(8'b00011011), .AC(8'b00011100), .AD(8'b00011101), .AE(8'b00011110), .AF(8'b00011111), .AG(8'b00100000), .AH(8'b00100001), .AI(8'b00100010), .AJ(8'b00100011), .AK(8'b00100100), .AL(8'b00100101), .AM(8'b00100110), .AN(8'b00100111), .AO(8'b00101000), .AP(8'b00101001), .AQ(8'b00101010), .AR(8'b00101011), .AS(8'b00101100), .AT(8'b00101101), .AU(8'b00101110), .AV(8'b00101111), .AW(8'b00110000), .AX(8'b00110001), .AY(8'b00110010), .AZ(8'b00110011), .BA(8'b00110100), .BB(8'b00110101), .BC(8'b00110110), .BD(8'b00110111), .BE(8'b00111000), .BF(8'b00111001), .BG(8'b00111010), .BH(8'b00111011), .CW(8'b01100100), .CX(8'b01100101), .CY(8'b01100110), .DA(8'b01101000), .DB(8'b01101001), .DC(8'b01101010), .DD(8'b01101011), .DE(8'b01101100), .DF(8'b01101101), .DG(8'b01101110), .DH(8'b01101111), .DI(8'b01110000), .DJ(8'b01110001), .DK(8'b01110010), .DL(8'b01110011), .DM(8'b01110100), .DN(8'b01110101), .DO(8'b01110110), .DP(8'b01110111), .FREE(8'b10010110), .SEA(8'b10010111), .SEB(8'b10011000), .SEC(8'b10011001), .SED(8'b10011010), .SEE(8'b10011100), .SEF(8'b10011101), .SEG(8'b10011110), .FD(8'b10011111), .FREE2(8'b10100000), .SWA(8'b10100001), .SWB(8'b10100010), .SWC(8'b10100011), .SWD(8'b10100100), .SWE(8'b10100101), .SWF(8'b10100110), .SWG(8'b10100111), .FM(8'b10101000), .FN(8'b10101001), .SNG(8'b10101010), .SSE(8'b10101011), .RWA(8'b10101100), .WAIT(8'b10101101), .WAIT2(8'b10101110), .WAIT3(8'b10101111), .WAIT4(8'b10110000), .FV(8'b10110001), .FW(8'b10110010), .FX(8'b10110011), .FY(8'b10110100), .GA(8'b10110110), .GB(8'b10110111), .GC(8'b10111000), .GD(8'b10111001), .GE(8'b10111010), .GF(8'b10111011), .GG(8'b10111100), .GH(8'b10111101), .GI(8'b10111110), .GJ(8'b10111111), .GK(8'b11000000), .GL(8'b11000001), .GM(8'b11000010), .GN(8'b11000011), .GO(8'b11000100), .GP(8'b11000101), .GQ(8'b11000110), .GR(8'b11000111), .GS(8'b11001000), .GT(8'b11001001), .GU(8'b11001010), .GV(8'b11001011), .GW(8'b11001100), .GX(8'b11001101), .GY(8'b11001110), .HA(8'b11010000), .HB(8'b11010001), .SSC(8'b11010010), .SSD(8'b11010011), .SSF(8'b11010100), .SSG(8'b11010101), .HG(8'b11010110), .HH(8'b11010111), .HI(8'b11011000), .HJ(8'b11011001), .HK(8'b11011010), .HL(8'b11011011), .RA(8'b11011100), .RB(8'b11011101), .RN(8'b11011110), .RNA(8'b11011111), .RS(8'b11100000), .RSA(8'b11100001), .RE(8'b11100010), .REA(8'b11100011), .RW(8'b11100100), .HV(8'b11100101), .SSA(8'b11100110), .SSB(8'b11100111), .SNA(8'b11101000), .SNB(8'b11101010), .SNC(8'b11101011), .SND(8'b11101100), .SNE(8'b11101101), .SNF(8'b11101110), .IF(8'b11101111), .IG(8'b11110000), .SRD(8'b11110001), .SRC(8'b11110010), .SRB(8'b11110011), .SRA(8'b11110100), .GSA(8'b11110101), .NRD(8'b11110110), .NRC(8'b11110111), .NRB(8'b11111000), .NRA(8'b11111001), .GNA(8'b11111010), .SS(8'b11111011), .SN(8'b11111100), .SE(8'b11111101), .SW(8'b11111110), .ERROR(8'b11111111), .IPbtl(8), .IPbtr(6), .IPa(5), .IPs(4), .IPver(2), .IPsend(0), .IPrec(1)) inst4 (
    .clk(clk), .en(en), .set(set), .SetIn(SET_MB), .inNorth(inst5_outsouth), .inEast(inst8_outwest),
    .inWest(inst_outeast), .outNorth(inst4_outnorth), .outEast(inst4_outeast), .outWest(inst4_outwest),
    .dispOut(inst4_dispout));  // open: inSouth, outSouth, outState
  blockV2 #(.inL(8), .outL(8), .empty(3'b000), .air(3'b001), .dirt(3'b010), .ground(3'b011), .queen(3'b100), .wall(3'b101), .errorblock(3'b110), .tunnel(3'b111), .START(8'b00110011), .A(8'b00000000), .B(8'b00000001), .C(8'b00000010), .D(8'b00000011), .E(8'b00000100), .F(8'b00000101), .G(8'b00000110), .H(8'b00000111), .I(8'b00001000), .J(8'b00001001), .K(8'b00001010), .L(8'b00001011), .M(8'b00001100), .N(8'b00001101), .O(8'b00001110), .P(8'b00001111), .Q(8'b00010000), .R(8'b00010001), .S(8'b00010010), .T(8'b00010011), .U(8'b00010100), .V(8'b00010101), .W(8'b00010110), .X(8'b00010111), .Y(8'b00011000), .Z(8'b00011001), .AA(8'b00011010), .AB(8'b00011011), .AC(8'b00011100), .AD(8'b00011101), .AE(8'b00011110), .AF(8'b00011111), .AG(8'b00100000), .AH(8'b00100001), .AI(8'b00100010), .AJ(8'b00100011), .AK(8'b00100100), .AL(8'b00100101), .AM(8'b00100110), .AN(8'b00100111), .AO(8'b00101000), .AP(8'b00101001), .AQ(8'b00101010), .AR(8'b00101011), .AS(8'b00101100), .AT(8'b00101101), .AU(8'b00101110), .AV(8'b00101111), .AW(8'b00110000), .AX(8'b00110001), .AY(8'b00110010), .AZ(8'b00110011), .BA(8'b00110100), .BB(8'b00110101), .BC(8'b00110110), .BD(8'b00110111), .BE(8'b00111000), .BF(8'b00111001), .BG(8'b00111010), .BH(8'b00111011), .CW(8'b01100100), .CX(8'b01100101), .CY(8'b01100110), .DA(8'b01101000), .DB(8'b01101001), .DC(8'b01101010), .DD(8'b01101011), .DE(8'b01101100), .DF(8'b01101101), .DG(8'b01101110), .DH(8'b01101111), .DI(8'b01110000), .DJ(8'b01110001), .DK(8'b01110010), .DL(8'b01110011), .DM(8'b01110100), .DN(8'b01110101), .DO(8'b01110110), .DP(8'b01110111), .FREE(8'b10010110), .SEA(8'b10010111), .SEB(8'b10011000), .SEC(8'b10011001), .SED(8'b10011010), .SEE(8'b10011100), .SEF(8'b10011101), .SEG(8'b10011110), .FD(8'b10011111), .FREE2(8'b10100000), .SWA(8'b10100001), .SWB(8'b10100010), .SWC(8'b10100011), .SWD(8'b10100100), .SWE(8'b10100101), .SWF(8'b10100110), .SWG(8'b10100111), .FM(8'b10101000), .FN(8'b10101001), .SNG(8'b10101010), .SSE(8'b10101011), .RWA(8'b10101100), .WAIT(8'b10101101), .WAIT2(8'b10101110), .WAIT3(8'b10101111), .WAIT4(8'b10110000), .FV(8'b10110001), .FW(8'b10110010), .FX(8'b10110011), .FY(8'b10110100), .GA(8'b10110110), .GB(8'b10110111), .GC(8'b10111000), .GD(8'b10111001), .GE(8'b10111010), .GF(8'b10111011), .GG(8'b10111100), .GH(8'b10111101), .GI(8'b10111110), .GJ(8'b10111111), .GK(8'b11000000), .GL(8'b11000001), .GM(8'b11000010), .GN(8'b11000011), .GO(8'b11000100), .GP(8'b11000101), .GQ(8'b11000110), .GR(8'b11000111), .GS(8'b11001000), .GT(8'b11001001), .GU(8'b11001010), .GV(8'b11001011), .GW(8'b11001100), .GX(8'b11001101), .GY(8'b11001110), .HA(8'b11010000), .HB(8'b11010001), .SSC(8'b11010010), .SSD(8'b11010011), .SSF(8'b11010100), .SSG(8'b11010101), .HG(8'b11010110), .HH(8'b11010111), .HI(8'b11011000), .HJ(8'b11011001), .HK(8'b11011010), .HL(8'b11011011), .RA(8'b11011100), .RB(8'b11011101), .RN(8'b11011110), .RNA(8'b11011111), .RS(8'b11100000), .RSA(8'b11100001), .RE(8'b11100010), .REA(8'b11100011), .RW(8'b11100100), .HV(8'b11100101), .SSA(8'b11100110), .SSB(8'b11100111), .SNA(8'b11101000), .SNB(8'b11101010), .SNC(8'b11101011), .SND(8'b11101100), .SNE(8'b11101101), .SNF(8'b11101110), .IF(8'b11101111), .IG(8'b11110000), .SRD(8'b11110001), .SRC(8'b11110010), .SRB(8'b11110011), .SRA(8'b11110100), .GSA(8'b11110101), .NRD(8'b11110110), .NRC(8'b11110111), .NRB(8'b11111000), .NRA(8'b11111001), .GNA(8'b11111010), .SS(8'b11111011), .SN(8'b11111100), .SE(8'b11111101), .SW(8'b11111110), .ERROR(8'b11111111), .IPbtl(8), .IPbtr(6), .IPa(5), .IPs(4), .IPver(2), .IPsend(0), .IPrec(1)) inst11 (
    .clk(clk), .en(en), .set(set), .SetIn(SET_RT), .inSouth(inst10_outnorth), .inEast(TopInEast),
    .inWest(inst7_outeast), .outSouth(inst11_outsouth), .outEast(TopOutEast), .outWest(inst11_outwest),
    .dispOut(inst11_dispout));  // open: inNorth, outNorth, outState
  blockV2 #(.inL(8), .outL(8), .empty(3'b000), .air(3'b001), .dirt(3'b010), .ground(3'b011), .queen(3'b100), .wall(3'b101), .errorblock(3'b110), .tunnel(3'b111), .START(8'b00110011), .A(8'b00000000), .B(8'b00000001), .C(8'b00000010), .D(8'b00000011), .E(8'b00000100), .F(8'b00000101), .G(8'b00000110), .H(8'b00000111), .I(8'b00001000), .J(8'b00001001), .K(8'b00001010), .L(8'b00001011), .M(8'b00001100), .N(8'b00001101), .O(8'b00001110), .P(8'b00001111), .Q(8'b00010000), .R(8'b00010001), .S(8'b00010010), .T(8'b00010011), .U(8'b00010100), .V(8'b00010101), .W(8'b00010110), .X(8'b00010111), .Y(8'b00011000), .Z(8'b00011001), .AA(8'b00011010), .AB(8'b00011011), .AC(8'b00011100), .AD(8'b00011101), .AE(8'b00011110), .AF(8'b00011111), .AG(8'b00100000), .AH(8'b00100001), .AI(8'b00100010), .AJ(8'b00100011), .AK(8'b00100100), .AL(8'b00100101), .AM(8'b00100110), .AN(8'b00100111), .AO(8'b00101000), .AP(8'b00101001), .AQ(8'b00101010), .AR(8'b00101011), .AS(8'b00101100), .AT(8'b00101101), .AU(8'b00101110), .AV(8'b00101111), .AW(8'b00110000), .AX(8'b00110001), .AY(8'b00110010), .AZ(8'b00110011), .BA(8'b00110100), .BB(8'b00110101), .BC(8'b00110110), .BD(8'b00110111), .BE(8'b00111000), .BF(8'b00111001), .BG(8'b00111010), .BH(8'b00111011), .CW(8'b01100100), .CX(8'b01100101), .CY(8'b01100110), .DA(8'b01101000), .DB(8'b01101001), .DC(8'b01101010), .DD(8'b01101011), .DE(8'b01101100), .DF(8'b01101101), .DG(8'b01101110), .DH(8'b01101111), .DI(8'b01110000), .DJ(8'b01110001), .DK(8'b01110010), .DL(8'b01110011), .DM(8'b01110100), .DN(8'b01110101), .DO(8'b01110110), .DP(8'b01110111), .FREE(8'b10010110), .SEA(8'b10010111), .SEB(8'b10011000), .SEC(8'b10011001), .SED(8'b10011010), .SEE(8'b10011100), .SEF(8'b10011101), .SEG(8'b10011110), .FD(8'b10011111), .FREE2(8'b10100000), .SWA(8'b10100001), .SWB(8'b10100010), .SWC(8'b10100011), .SWD(8'b10100100), .SWE(8'b10100101), .SWF(8'b10100110), .SWG(8'b10100111), .FM(8'b10101000), .FN(8'b10101001), .SNG(8'b10101010), .SSE(8'b10101011), .RWA(8'b10101100), .WAIT(8'b10101101), .WAIT2(8'b10101110), .WAIT3(8'b10101111), .WAIT4(8'b10110000), .FV(8'b10110001), .FW(8'b10110010), .FX(8'b10110011), .FY(8'b10110100), .GA(8'b10110110), .GB(8'b10110111), .GC(8'b10111000), .GD(8'b10111001), .GE(8'b10111010), .GF(8'b10111011), .GG(8'b10111100), .GH(8'b10111101), .GI(8'b10111110), .GJ(8'b10111111), .GK(8'b11000000), .GL(8'b11000001), .GM(8'b11000010), .GN(8'b11000011), .GO(8'b11000100), .GP(8'b11000101), .GQ(8'b11000110), .GR(8'b11000111), .GS(8'b11001000), .GT(8'b11001001), .GU(8'b11001010), .GV(8'b11001011), .GW(8'b11001100), .GX(8'b11001101), .GY(8'b11001110), .HA(8'b11010000), .HB(8'b11010001), .SSC(8'b11010010), .SSD(8'b11010011), .SSF(8'b11010100), .SSG(8'b11010101), .HG(8'b11010110), .HH(8'b11010111), .HI(8'b11011000), .HJ(8'b11011001), .HK(8'b11011010), .HL(8'b11011011), .RA(8'b11011100), .RB(8'b11011101), .RN(8'b11011110), .RNA(8'b11011111), .RS(8'b11100000), .RSA(8'b11100001), .RE(8'b11100010), .REA(8'b11100011), .RW(8'b11100100), .HV(8'b11100101), .SSA(8'b11100110), .SSB(8'b11100111), .SNA(8'b11101000), .SNB(8'b11101010), .SNC(8'b11101011), .SND(8'b11101100), .SNE(8'b11101101), .SNF(8'b11101110), .IF(8'b11101111), .IG(8'b11110000), .SRD(8'b11110001), .SRC(8'b11110010), .SRB(8'b11110011), .SRA(8'b11110100), .GSA(8'b11110101), .NRD(8'b11110110), .NRC(8'b11110111), .NRB(8'b11111000), .NRA(8'b11111001), .GNA(8'b11111010), .SS(8'b11111011), .SN(8'b11111100), .SE(8'b11111101), .SW(8'b11111110), .ERROR(8'b11111111), .IPbtl(8), .IPbtr(6), .IPa(5), .IPs(4), .IPver(2), .IPsend(0), .IPrec(1)) inst10 (
    .clk(clk), .en(en), .set(set), .SetIn(SET_RMT), .inNorth(inst11_outsouth), .inSouth(inst9_outnorth),
    .inEast(MiddleTinEast), .inWest(inst6_outeast), .outNorth(inst10_outnorth), .outSouth(inst10_outsouth),
    .outEast(MiddleTOutEast), .outWest(inst10_outwest), .dispOut(inst10_dispout));  // open: outState
  blockV2 #(.inL(8), .outL(8), .empty(3'b000), .air(3'b001), .dirt(3'b010), .ground(3'b011), .queen(3'b100), .wall(3'b101), .errorblock(3'b110), .tunnel(3'b111), .START(8'b00110011), .A(8'b00000000), .B(8'b00000001), .C(8'b00000010), .D(8'b00000011), .E(8'b00000100), .F(8'b00000101), .G(8'b00000110), .H(8'b00000111), .I(8'b00001000), .J(8'b00001001), .K(8'b00001010), .L(8'b00001011), .M(8'b00001100), .N(8'b00001101), .O(8'b00001110), .P(8'b00001111), .Q(8'b00010000), .R(8'b00010001), .S(8'b00010010), .T(8'b00010011), .U(8'b00010100), .V(8'b00010101), .W(8'b00010110), .X(8'b00010111), .Y(8'b00011000), .Z(8'b00011001), .AA(8'b00011010), .AB(8'b00011011), .AC(8'b00011100), .AD(8'b00011101), .AE(8'b00011110), .AF(8'b00011111), .AG(8'b00100000), .AH(8'b00100001), .AI(8'b00100010), .AJ(8'b00100011), .AK(8'b00100100), .AL(8'b00100101), .AM(8'b00100110), .AN(8'b00100111), .AO(8'b00101000), .AP(8'b00101001), .AQ(8'b00101010), .AR(8'b00101011), .AS(8'b00101100), .AT(8'b00101101), .AU(8'b00101110), .AV(8'b00101111), .AW(8'b00110000), .AX(8'b00110001), .AY(8'b00110010), .AZ(8'b00110011), .BA(8'b00110100), .BB(8'b00110101), .BC(8'b00110110), .BD(8'b00110111), .BE(8'b00111000), .BF(8'b00111001), .BG(8'b00111010), .BH(8'b00111011), .CW(8'b01100100), .CX(8'b01100101), .CY(8'b01100110), .DA(8'b01101000), .DB(8'b01101001), .DC(8'b01101010), .DD(8'b01101011), .DE(8'b01101100), .DF(8'b01101101), .DG(8'b01101110), .DH(8'b01101111), .DI(8'b01110000), .DJ(8'b01110001), .DK(8'b01110010), .DL(8'b01110011), .DM(8'b01110100), .DN(8'b01110101), .DO(8'b01110110), .DP(8'b01110111), .FREE(8'b10010110), .SEA(8'b10010111), .SEB(8'b10011000), .SEC(8'b10011001), .SED(8'b10011010), .SEE(8'b10011100), .SEF(8'b10011101), .SEG(8'b10011110), .FD(8'b10011111), .FREE2(8'b10100000), .SWA(8'b10100001), .SWB(8'b10100010), .SWC(8'b10100011), .SWD(8'b10100100), .SWE(8'b10100101), .SWF(8'b10100110), .SWG(8'b10100111), .FM(8'b10101000), .FN(8'b10101001), .SNG(8'b10101010), .SSE(8'b10101011), .RWA(8'b10101100), .WAIT(8'b10101101), .WAIT2(8'b10101110), .WAIT3(8'b10101111), .WAIT4(8'b10110000), .FV(8'b10110001), .FW(8'b10110010), .FX(8'b10110011), .FY(8'b10110100), .GA(8'b10110110), .GB(8'b10110111), .GC(8'b10111000), .GD(8'b10111001), .GE(8'b10111010), .GF(8'b10111011), .GG(8'b10111100), .GH(8'b10111101), .GI(8'b10111110), .GJ(8'b10111111), .GK(8'b11000000), .GL(8'b11000001), .GM(8'b11000010), .GN(8'b11000011), .GO(8'b11000100), .GP(8'b11000101), .GQ(8'b11000110), .GR(8'b11000111), .GS(8'b11001000), .GT(8'b11001001), .GU(8'b11001010), .GV(8'b11001011), .GW(8'b11001100), .GX(8'b11001101), .GY(8'b11001110), .HA(8'b11010000), .HB(8'b11010001), .SSC(8'b11010010), .SSD(8'b11010011), .SSF(8'b11010100), .SSG(8'b11010101), .HG(8'b11010110), .HH(8'b11010111), .HI(8'b11011000), .HJ(8'b11011001), .HK(8'b11011010), .HL(8'b11011011), .RA(8'b11011100), .RB(8'b11011101), .RN(8'b11011110), .RNA(8'b11011111), .RS(8'b11100000), .RSA(8'b11100001), .RE(8'b11100010), .REA(8'b11100011), .RW(8'b11100100), .HV(8'b11100101), .SSA(8'b11100110), .SSB(8'b11100111), .SNA(8'b11101000), .SNB(8'b11101010), .SNC(8'b11101011), .SND(8'b11101100), .SNE(8'b11101101), .SNF(8'b11101110), .IF(8'b11101111), .IG(8'b11110000), .SRD(8'b11110001), .SRC(8'b11110010), .SRB(8'b11110011), .SRA(8'b11110100), .GSA(8'b11110101), .NRD(8'b11110110), .NRC(8'b11110111), .NRB(8'b11111000), .NRA(8'b11111001), .GNA(8'b11111010), .SS(8'b11111011), .SN(8'b11111100), .SE(8'b11111101), .SW(8'b11111110), .ERROR(8'b11111111), .IPbtl(8), .IPbtr(6), .IPa(5), .IPs(4), .IPver(2), .IPsend(0), .IPrec(1)) inst9 (
    .clk(clk), .en(en), .set(set), .SetIn(SET_RMB), .inNorth(inst10_outsouth), .inSouth(inst8_outnorth),
    .inEast(MiddleBinEast), .inWest(inst5_outeast), .outNorth(inst9_outnorth), .outSouth(inst9_outsouth),
    .outEast(MiddleBOutEast), .outWest(inst9_outwest), .dispOut(inst9_dispout));  // open: outState
  blockV2 #(.inL(8), .outL(8), .empty(3'b000), .air(3'b001), .dirt(3'b010), .ground(3'b011), .queen(3'b100), .wall(3'b101), .errorblock(3'b110), .tunnel(3'b111), .START(8'b00110011), .A(8'b00000000), .B(8'b00000001), .C(8'b00000010), .D(8'b00000011), .E(8'b00000100), .F(8'b00000101), .G(8'b00000110), .H(8'b00000111), .I(8'b00001000), .J(8'b00001001), .K(8'b00001010), .L(8'b00001011), .M(8'b00001100), .N(8'b00001101), .O(8'b00001110), .P(8'b00001111), .Q(8'b00010000), .R(8'b00010001), .S(8'b00010010), .T(8'b00010011), .U(8'b00010100), .V(8'b00010101), .W(8'b00010110), .X(8'b00010111), .Y(8'b00011000), .Z(8'b00011001), .AA(8'b00011010), .AB(8'b00011011), .AC(8'b00011100), .AD(8'b00011101), .AE(8'b00011110), .AF(8'b00011111), .AG(8'b00100000), .AH(8'b00100001), .AI(8'b00100010), .AJ(8'b00100011), .AK(8'b00100100), .AL(8'b00100101), .AM(8'b00100110), .AN(8'b00100111), .AO(8'b00101000), .AP(8'b00101001), .AQ(8'b00101010), .AR(8'b00101011), .AS(8'b00101100), .AT(8'b00101101), .AU(8'b00101110), .AV(8'b00101111), .AW(8'b00110000), .AX(8'b00110001), .AY(8'b00110010), .AZ(8'b00110011), .BA(8'b00110100), .BB(8'b00110101), .BC(8'b00110110), .BD(8'b00110111), .BE(8'b00111000), .BF(8'b00111001), .BG(8'b00111010), .BH(8'b00111011), .CW(8'b01100100), .CX(8'b01100101), .CY(8'b01100110), .DA(8'b01101000), .DB(8'b01101001), .DC(8'b01101010), .DD(8'b01101011), .DE(8'b01101100), .DF(8'b01101101), .DG(8'b01101110), .DH(8'b01101111), .DI(8'b01110000), .DJ(8'b01110001), .DK(8'b01110010), .DL(8'b01110011), .DM(8'b01110100), .DN(8'b01110101), .DO(8'b01110110), .DP(8'b01110111), .FREE(8'b10010110), .SEA(8'b10010111), .SEB(8'b10011000), .SEC(8'b10011001), .SED(8'b10011010), .SEE(8'b10011100), .SEF(8'b10011101), .SEG(8'b10011110), .FD(8'b10011111), .FREE2(8'b10100000), .SWA(8'b10100001), .SWB(8'b10100010), .SWC(8'b10100011), .SWD(8'b10100100), .SWE(8'b10100101), .SWF(8'b10100110), .SWG(8'b10100111), .FM(8'b10101000), .FN(8'b10101001), .SNG(8'b10101010), .SSE(8'b10101011), .RWA(8'b10101100), .WAIT(8'b10101101), .WAIT2(8'b10101110), .WAIT3(8'b10101111), .WAIT4(8'b10110000), .FV(8'b10110001), .FW(8'b10110010), .FX(8'b10110011), .FY(8'b10110100), .GA(8'b10110110), .GB(8'b10110111), .GC(8'b10111000), .GD(8'b10111001), .GE(8'b10111010), .GF(8'b10111011), .GG(8'b10111100), .GH(8'b10111101), .GI(8'b10111110), .GJ(8'b10111111), .GK(8'b11000000), .GL(8'b11000001), .GM(8'b11000010), .GN(8'b11000011), .GO(8'b11000100), .GP(8'b11000101), .GQ(8'b11000110), .GR(8'b11000111), .GS(8'b11001000), .GT(8'b11001001), .GU(8'b11001010), .GV(8'b11001011), .GW(8'b11001100), .GX(8'b11001101), .GY(8'b11001110), .HA(8'b11010000), .HB(8'b11010001), .SSC(8'b11010010), .SSD(8'b11010011), .SSF(8'b11010100), .SSG(8'b11010101), .HG(8'b11010110), .HH(8'b11010111), .HI(8'b11011000), .HJ(8'b11011001), .HK(8'b11011010), .HL(8'b11011011), .RA(8'b11011100), .RB(8'b11011101), .RN(8'b11011110), .RNA(8'b11011111), .RS(8'b11100000), .RSA(8'b11100001), .RE(8'b11100010), .REA(8'b11100011), .RW(8'b11100100), .HV(8'b11100101), .SSA(8'b11100110), .SSB(8'b11100111), .SNA(8'b11101000), .SNB(8'b11101010), .SNC(8'b11101011), .SND(8'b11101100), .SNE(8'b11101101), .SNF(8'b11101110), .IF(8'b11101111), .IG(8'b11110000), .SRD(8'b11110001), .SRC(8'b11110010), .SRB(8'b11110011), .SRA(8'b11110100), .GSA(8'b11110101), .NRD(8'b11110110), .NRC(8'b11110111), .NRB(8'b11111000), .NRA(8'b11111001), .GNA(8'b11111010), .SS(8'b11111011), .SN(8'b11111100), .SE(8'b11111101), .SW(8'b11111110), .ERROR(8'b11111111), .IPbtl(8), .IPbtr(6), .IPa(5), .IPs(4), .IPver(2), .IPsend(0), .IPrec(1)) inst8 (
    .clk(clk), .en(en), .set(set), .SetIn(SET_RB), .inNorth(inst9_outsouth), .inEast(BottominEast),
    .inWest(inst4_outeast), .outNorth(inst8_outnorth), .outEast(BottomOutEast), .outWest(inst8_outwest),
    .dispOut(inst8_dispout));  // open: inSouth, outSouth, outState
  columnencoderV2 inst18 (
    .three(inst11_dispout), .two(inst10_dispout), .one(inst9_dispout), .zero(inst8_dispout), .ColOut(columnL));
  columnencoderV2 inst17 (
    .three(inst7_dispout), .two(inst6_dispout), .one(inst5_dispout), .zero(inst4_dispout), .ColOut(columnM));
  columnencoderV2 inst16 (
    .three(inst3_dispout), .two(inst2_dispout), .one(inst1_dispout), .zero(inst_dispout), .ColOut(columnR));
endmodule
